# EAGLE schematic Analog Electronics Fundamentals 103 - Lab4 Schematic (EAGLE 6.2)
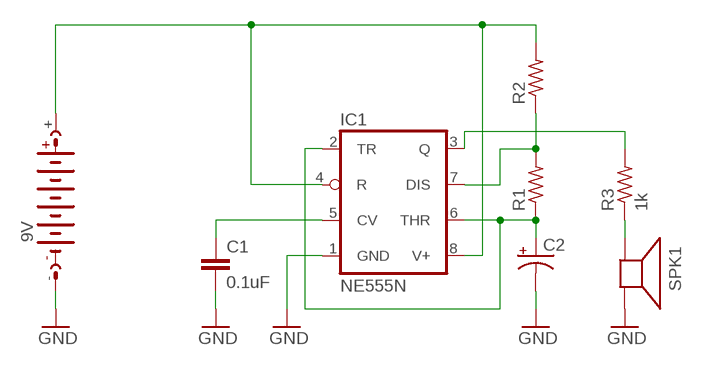
[diagram p0: schematic, sheet 1]

## Parts
9V  AB9V  [AB9V]
C1  0.1uF  C-EU025-024X044  [C025-024X044]
C2  CPOL-USTT5D11  [TT5D11]
IC1  NE555N  [DIL08]
R1  R-US_0204/7  [0204/7]
R2  R-US_0204/7  [0204/7]
R3  1k  R-US_0204/7  [0204/7]
SPK1  SMT-0540-S-R  [SMT-0540-S-R]

## Nets
GND: 9V.- C1.2 C2.- IC1.1(GND) SPK1.+(-)
N$1: 9V.+ IC1.4(R) IC1.8(V+) R2.2
N$2: IC1.7(DIS) R1.2 R2.1
N$3: R3.1 SPK1.-(+)
N$4: IC1.3(Q) R3.2
N$5: C1.1 IC1.5(CV)
N$6: C2.+ IC1.2(TR) IC1.6(THR) R1.1

## Library data of the parts
9V = battery:AB9V: 9-V BATTERY CLIP
C1 = resistor:C-EU: CAPACITOR, European symbol
C2 = resistor:CPOL-US: POLARIZED CAPACITOR, American symbol
IC1 = linear:*555: TIMER
R1-R3 = resistor:R-US_: RESISTOR, American symbol
SPK1 = adafruit:SMT-0540-S-R: SMT-0549-S-R Small surface-mount magnetic buzzer